# EAGLE design EvalBoard_SwitchingPS_v0.1a (EAGLE 9.4.1)
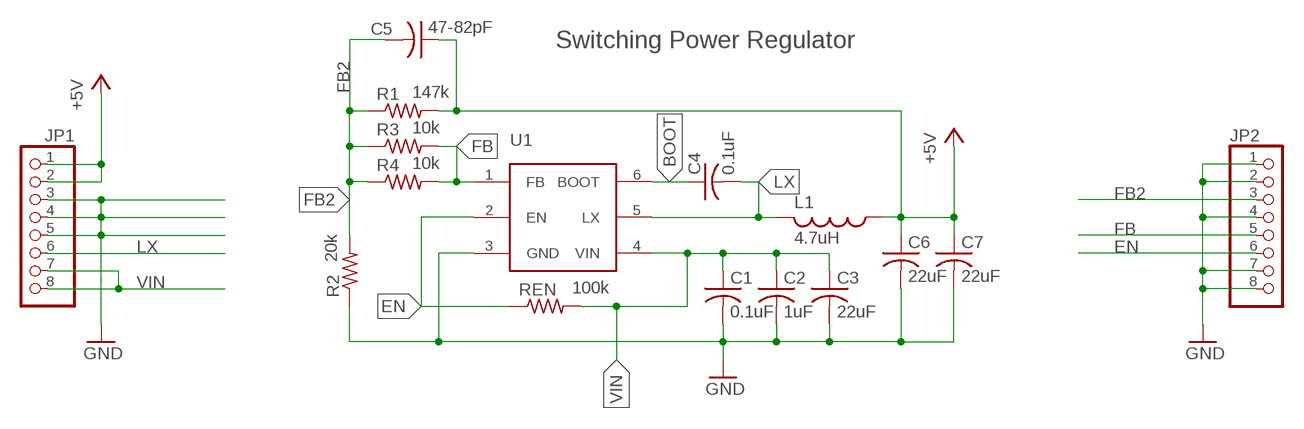
[diagram p0: schematic, sheet 1]

## Parts
C1  0.1uF  C-USC0603  [C0603]
C2  1uF  C-USC0603  [C0603]
C3  22uF  C-USC1206  [C1206]
C4  0.1uF  C-USC0603  [C0603]
C5  47-82pF  C-USC0603  [C0603]
C6  22uF  C-USC1206  [C1206]
C7  22uF  C-USC1206  [C1206]
JP1  PINHD-1X8BIG  [1X08-BIG]
JP2  PINHD-1X8BIG  [1X08-BIG]
L1  4.7uH  L-US0207/15  [0207/15]
R1  147k  R-US_R0603  [R0603]
R2  20k  R-US_R0603  [R0603]
R3  10k  R-US_R0603  [R0603]
R4  10k  R-US_R0603  [R0603]
REN  100k  R-US_R0603  [R0603]
U1  RT6255AHGJ6FCT-ND  RT6255A/B_J6F  [SOT-23-6]

## Nets
+5V: C5.1 C6.1 C7.1 JP1.1 JP1.2 L1.1 R1.2
BOOT: C4.1 U1.6(BOOT)
EN: JP2.6 REN.1 U1.2(EN)
FB: JP2.5 R3.2 R4.2 U1.1(FB)
FB2: C5.2 JP2.3 R1.1 R2.2 R3.1 R4.1
GND: C1.2 C2.2 C3.2 C6.2 C7.2 JP1.3 JP1.4 JP1.5 JP2.1 JP2.2 JP2.4 JP2.7 JP2.8 R2.1 U1.3(GND)
LX: C4.2 JP1.6 L1.2 U1.5(LX)
VIN: C1.1 C2.1 C3.1 JP1.7 JP1.8 REN.2 U1.4(VIN)

## Notes on the sheet
- Switching Power Regulator

## Library data of the parts
C1-C7 = resistor_mod:C-US: CAPACITOR, American symbol
JP1 JP2 = adafruit:PINHD-1X8: PIN HEADER
L1 = resistor:L-US: INDUCTOR, American symbol
R1-R4 REN = resistor_mod:R-US_: RESISTOR, American symbol
U1 = MonthCalendar:RT6255A/B_J6F: Richtek - RT6255A/B_J6F Step-Down Converter - 5A, 4.5-18V Input, 500kHz Switching Frequency

## Board
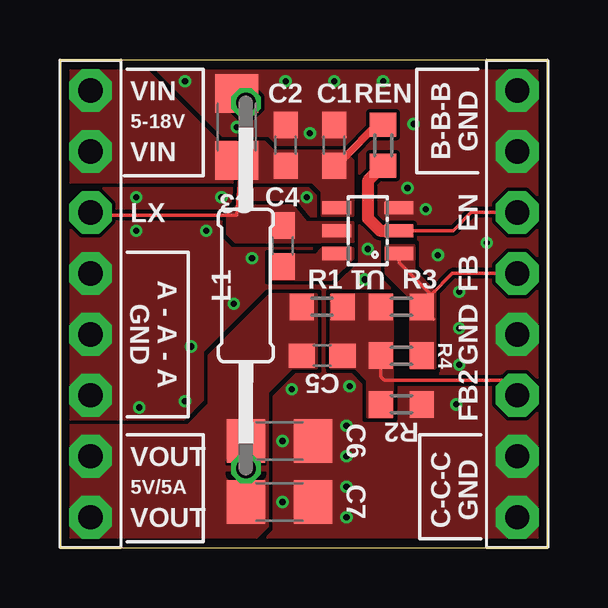
[diagram p1: board, top side]
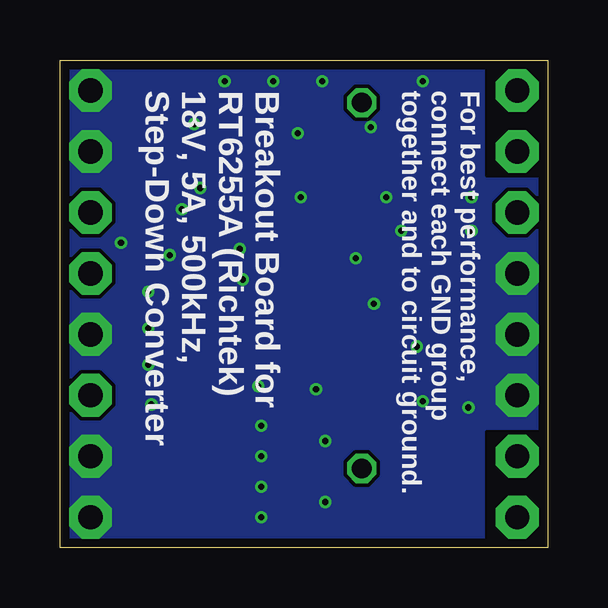
[diagram p2: board, bottom side, seen from below]

Size 20.32 x 20.32 mm. Coordinates in mm from the lower left corner, seen from the top.
Outline: 0,0 20.32,0 20.32,20.32 0,20.32 0,0
Copper layers (1*16): Top 0.035559375mm / dielectric 1.6mm / Bottom 0.035559375mm
Design rules "oshpark-2layer-tented": minimum track width 6mil, minimum drill 10mil, track to track 6mil, track to pad 6mil, pad to pad 6mil, via to via 6mil, smd to smd 6mil, copper to edge 15mil, drill to drill 6mil, minimum pad ring 5mil, minimum via ring 5mil, stop-mask expansion 2.5mil, vias tented up to drill 20mil, thermal gap 10mil
bRestrict: area 0,15.5 to 2.5,20.3; area 0,0 to 2.5,4.8

### Footprints (pad centres in the part's own frame; a part is rotated, then mirrored left to right if it is on the bottom)
C0603 = smd 1.1 x 1: 1 -0.85,0; 2 0.85,0
C1206 = smd 1.6 x 1.8: 1 -1.4,0; 2 1.4,0
1X08-BIG = drill 1.016 pad 1.778 octagon: 1 -8.89,0; 2 -6.35,0; 3 -3.81,0; 4 -1.27,0; 5 1.27,0; 6 3.81,0; 7 6.35,0; 8 8.89,0
0207/15 = drill 0.813 octagon: 1 -7.62,0; 2 7.62,0
R0603 = smd 1 x 1.1: 1 -0.85,0; 2 0.85,0
SOT-23-6 = smd 0.55 x 1.2: 1 -0.95,-1.3; 2 0,-1.3; 3 0.95,-1.3; 4 0.95,1.3; 5 0,1.3; 6 -0.95,1.3

### Placement (x,y rotation side)
C1  11.43,16.76 90 top
C2  9.4,16.76 90 top
C3  7.37,17.53 90 top
C4  9.27,12.57 90 top
C5  10.92,8 0 top
C6  9.14,4.45 0 top
C7  9.14,1.91 0 top
JP1  1.27,10.16 90 top
JP2  19.05,10.16 90 top
L1  7.75,10.92 90 top
R1  10.92,10.03 180 top
R2  14.22,5.97 180 top
R3  14.22,10.03 0 top
R4  14.22,8 0 top
REN  13.46,16.76 90 top
U1  12.83,13.21 90 top

### Tracks (layer width: path | path; a pad name or v marks a point on that pad's centre or on a via)
+5V
  pour Top: 0,5.08 0,0 7.75,0 8.64,0.89 8.64,6.48 9.65,7.49 10.67,7.49 10.67,10.54 8.76,10.54 6.22,8 6.22,5.97 5.33,5.08
BOOT
  pour Top: 8.76,12.19 10.67,12.19 10.92,12.45 12.19,12.45 12.19,12.06 11.3,11.18 8.76,11.18
EN
  Top 0.152: U1.2 16.38,13.21 17.14,13.97 JP2.6
  Top 0.508: REN.1 12.83,15.28 12.83,13.72 13.34,13.21 U1.2
FB
  Top 0.152: R3.2 15.58,9.53 | 19.18,11.43 JP2.5 16.35,11.43 15.46,10.54 14.13,11.88 U1.1
  pour Top: 14.61,7.49 14.61,10.41 13.59,11.43 13.59,12.57 14.73,12.57 14.73,11.56 15.62,10.67 15.62,7.49
FB2
  Top 0.152: R4.1 13.37,7.11 13.5,6.99 18.41,6.99 JP2.3
  pour Top: 11.3,10.54 11.3,7.49 12.32,7.49 12.83,6.99 12.83,5.46 13.84,5.46 13.84,10.54
GND  (via drill 0.25)
  other vias: 9.4,19.43 11.43,19.43 14.73,17.65 15.24,14.1 16.64,10.67 12.83,12.45 12.7,11.18 8,12.06 10.29,14.61 3.17,14.61 3.17,13.21 6.1,13.21 5.46,8.38 9.27,1.91 9.27,4.45 9.65,6.6 16.51,5.97 16.64,7.62 15.75,12.19 6.73,14.61 11.94,5.08 11.94,2.54 5.21,19.43 7.24,10.16 17.78,12.7 10.41,17.27 7.37,17.53 11.94,3.81 11.94,1.27 5.21,6.1 12.06,6.73 16.64,9.14 14.48,14.99 13.46,19.43 3.3,5.84
  pour Top (rank 2): 0,20.32 0,0 20.32,0 20.32,20.32
  pour Bottom (rank 2): 0,20.32 0,0 20.32,0 20.32,20.32
LX
  Top 0.152: JP1.6 1.4,13.84 7.37,13.84 L1.2
  pour Top: 12.19,13.54 10.26,13.54 9.69,14.22 7.37,14.22 6.99,13.84 6.99,13.08 7.32,12.75 12.19,12.75
VIN
  Top 0.305: REN.2 13.21,17.61 11.85,16.26 11.56,16.26 11.43,16.13 C1.1
  pour Top: 12.19,13.84 10.92,13.84 10.92,14.86 10.54,15.24 0,15.24 0,20.32 3.17,20.32 6.6,16.89 8.51,16.89 8.89,16.51 11.81,16.51 12.19,16.13

### Text on the board
tPlace: VIN | 5-18V | B-B-B | GND | VIN | LX | EN | FB | GND | A - A - A | GND | FB2 | VOUT | 5V/5A | C-C-C | GND | VOUT
bPlace: For best performance, / connect each GND group / together and to circuit ground. | Breakout Board for / RT6255A (Richtek) / 18V, 5A, 500kHz, / Step-Down Converter